# Altium schematic sheet CTR_MCU_Signals.SchDoc: PWM and Sensor Signals
size A4; DrawnBy: Andrei Divinagracia; Revision: 0A; SheetNumber: 7; SheetTotal: 10
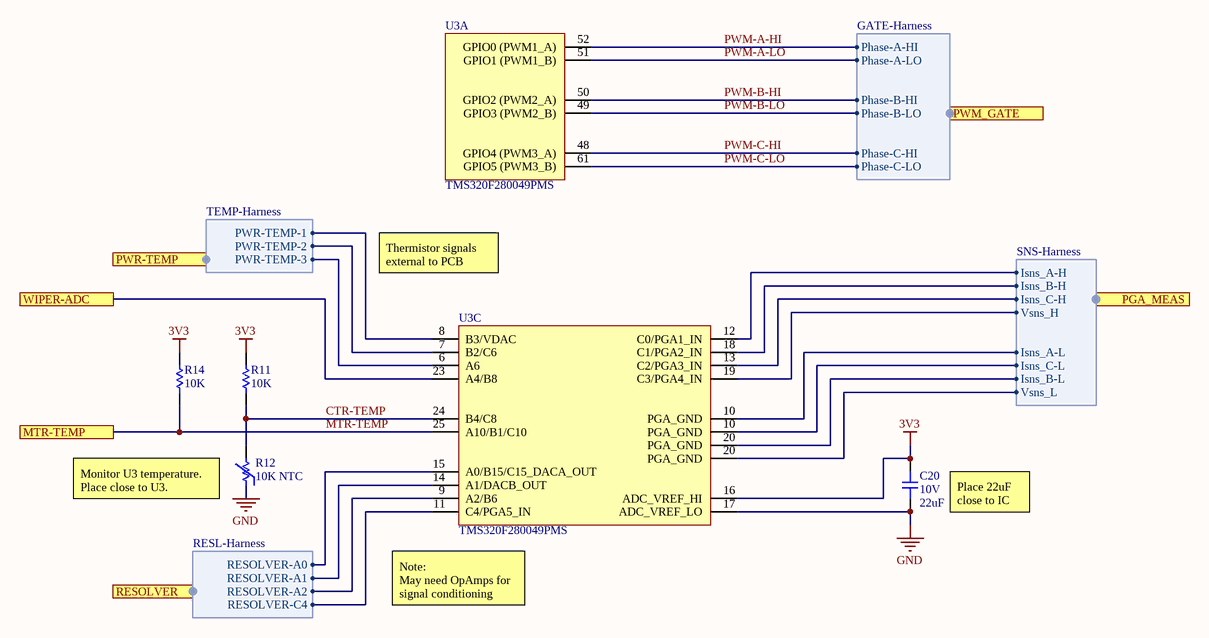
[diagram p0: CTR_MCU_Signals.SchDoc]

## Parts
C20  Voltage Rating: 10V  Capacitance: 22uF  [CAP-0603]  (hidden comment: 0603-22uF-10V)
R11  10K  [RES-0603]
R12  10K NTC  [RES-0603]
R14  10K  [RES-0603]
U3  TMS320F280049PMS  [64QFP]  (parts A,C of 5)

## Ports
MTR-TEMP, PGA_MEAS (harness SNS-Harness), PWM_GATE (harness GATE-Harness), PWR-TEMP (harness TEMP-Harness), RESOLVER (harness RESL-Harness), WIPER-ADC

## Harnesses
SNS-Harness: Isns_A-H, Isns_B-H, Isns_C-H, Vsns_H, Isns_A-L, Isns_B-L, Isns_C-L, Vsns_L
TEMP-Harness: PWR-TEMP-1, PWR-TEMP-2, PWR-TEMP-3
GATE-Harness: Phase-A-HI, Phase-A-LO, Phase-B-HI, Phase-B-LO, Phase-C-LO, Phase-C-HI
RESL-Harness: RESOLVER-A0, RESOLVER-A1, RESOLVER-A2, RESOLVER-C4

## Nets
3V3: C20.2 R11.2 R14.2 U3.16(ADC_VREF_HI)
GND: C20.1 R12.1 U3.17(ADC_VREF_LO)
CTR-TEMP: R11.1 R12.2 U3.24(B4/C8)
MTR-TEMP: R14.1 U3.25(A10/B1/C10) ; port MTR-TEMP
PWM-A-HI: U3.52(GPIO0_(PWM1_A)) ; port PWM_GATE.Phase-A-HI
PWM-A-LO: U3.51(GPIO1_(PWM1_B)) ; port PWM_GATE.Phase-A-LO
PWM-B-HI: U3.50(GPIO2_(PWM2_A)) ; port PWM_GATE.Phase-B-HI
PWM-B-LO: U3.49(GPIO3_(PWM2_B)) ; port PWM_GATE.Phase-B-LO
PWM-C-HI: U3.48(GPIO4_(PWM3_A)) ; port PWM_GATE.Phase-C-HI
PWM-C-LO: U3.61(GPIO5_(PWM3_B)) ; port PWM_GATE.Phase-C-LO
WIPER-ADC: U3.23(A4/B8) ; port WIPER-ADC
NetU3_6: U3.6(A6) ; port PWR-TEMP.PWR-TEMP-3
NetU3_7: U3.7(B2/C6) ; port PWR-TEMP.PWR-TEMP-2
NetU3_8: U3.8(B3/VDAC) ; port PWR-TEMP.PWR-TEMP-1
NetU3_9: U3.9(A2/B6) ; port RESOLVER.RESOLVER-A2
NetU3_10: U3.10(PGA_GND) ; port PGA_MEAS.Isns_C-L
NetU3_10: U3.10(PGA_GND) ; port PGA_MEAS.Isns_A-L  [a separate net that carries the same name]
NetU3_11: U3.11(C4/PGA5_IN) ; port RESOLVER.RESOLVER-C4
NetU3_12: U3.12(C0/PGA1_IN) ; port PGA_MEAS.Isns_A-H
NetU3_13: U3.13(C2/PGA3_IN) ; port PGA_MEAS.Isns_C-H
NetU3_14: U3.14(A1/DACB_OUT) ; port RESOLVER.RESOLVER-A1
NetU3_15: U3.15(A0/B15/C15_DACA_OUT) ; port RESOLVER.RESOLVER-A0
NetU3_18: U3.18(C1/PGA2_IN) ; port PGA_MEAS.Isns_B-H
NetU3_19: U3.19(C3/PGA4_IN) ; port PGA_MEAS.Vsns_H
NetU3_20: U3.20(PGA_GND) ; port PGA_MEAS.Isns_B-L
NetU3_20: U3.20(PGA_GND) ; port PGA_MEAS.Vsns_L  [a separate net that carries the same name]

## Notes on the sheet
- Thermistor signals external to PCB
- (near R12) Monitor U3 temperature. Place close to U3.
- (near C20) Place 22uF close to IC
- (near U3) Note:
  May need OpAmps for signal conditioning

## Library data of the parts
C20 = 0603-22uF-10V: CAP CER 22UF 10V X5R 0603; Manufacturer: Murata; Manufacturer Part Number: GRM187R61A226ME15D; Tolerance: 20%; Supplier 1: Digi-Key; Stock 1: 534733; Pricing 1: 1=0.54, 10=0.381, 50=0.2884, 100=0.2512, 500=0.18608, 1000=0.15816 (USD); Mount: Surface Mount; Case/Package: 0603; Case Code (Metric): 1608; Case Code (Imperial): 0603; Min Operating Temperature: -55°C; Max Operating Temperature: 85°C; Packaging: Tape and Reel; Voltage Rating (DC): 10V; Dielectric: X5R; Length: 0.063inch; Width: 0.031inch; Thickness: 0.031inch; RoHS Compliant: Yes; ComponentLink1URL: http://search.murata.co.jp/Ceramy/image/img/A01X/G101/ENG/GRM187R61A226ME15-01.pdf?src-supplier=Digi-Key; ComponentLink1Description: http://search.murata.co.jp/Ceramy/image/img/A01X/G101/ENG/GRM187R61A226ME15-01.pdf?src-supplier=Digi-Key; Supplier Part Number 1: 490-13243-1-ND
R11 R14 = 0603-10KR: RES SMD 10K OHM 5% 1/10W 0603; Manufacturer: Yageo; Manufacturer Part Number: RC0603JR-0710KL; Resistance: 10kR; Voltage Rating (DC): 50V; Temperature Coefficient: 100ppm/°C; Power Rating: 100mW; Supplier 1: Digi-Key; Stock 1: 3006558; Pricing 1: 1=0.1, 10=0.019, 100=0.0077, 1000=0.00347, 2500=0.00301 (USD); Case/Package: 0603; Number of Pins: 2; Contact Plating: Tin,Matte; Case Code (Imperial): 0603; Case Code (Metric): 1608; Min Operating Temperature: -55°C; Max Operating Temperature: 155°C; Packaging: Tape and Reel; Tolerance: 5%; Composition: Thick Film; Voltage Rating: 50V; Termination: SMD/SMT; Military Standard: Not; Features: Moisture Resistant; Max Power Dissipation: 100mW; Number of Terminations: 2; Length: 0.063inch; Width: 0.031inch; Depth: 0.8mm; Height - Seated (Max): 0.022inch; Radiation Hardening: No; REACH SVHC: Unknown; Lead Free: Lead Free; ComponentLink1URL: http://www.yageo.com/documents/recent/PYu-RC_Group_51_RoHS_L_10.pdf?src-supplier=Digi-Key; ComponentLink1Description: http://www.yageo.com/documents/recent/PYu-RC_Group_51_RoHS_L_10.pdf?src-supplier=Digi-Key; Supplier Part Number 1: 311-10KGRDKR-ND
R12 = 0603-10K-thermistor: THERMISTOR NTC 10KOHM 3380K 0603; Manufacturer: Murata; Manufacturer Part Number: NCP18XH103F03RB; Resistance: 10kR; Tolerance: 1%; Power Rating: 100mW; Current Rating: 310uA; Accuracy: 0.7%; Supplier 1: Digi-Key; Stock 1: 66922; Pricing 1: 1=0.24, 5=0.23, 10=0.204, 25=0.1876, 50=0.15, 100=0.1286, 500=0.1125, 1000=0.09643 (USD); Mount: Surface Mount; Case/Package: 0603; Number of Pins: 2; Case Code (Metric): 1608; Case Code (Imperial): 0603; Number of Terminals: 2; Min Operating Temperature: -40°C; Max Operating Temperature: 125°C; Packaging: Tape and Reel; Package Quantity: 1; Termination: SMD/SMT; Max Power Dissipation: 100mW; Length: 1.6mm; Height: 0.8mm; Depth: 0.8mm; Radiation Hardening: No; REACH SVHC: No SVHC; Lead Free: Lead Free; ComponentLink1URL: http://www.mouser.com/ds/2/281/r44e-522712.pdf?src-supplier=Mouser; ComponentLink1Description: http://www.mouser.com/ds/2/281/r44e-522712.pdf?src-supplier=Mouser; ComponentLink2URL: http://uk.rs-online.com/webdocs/07f1/0900766b807f1e39.pdf?src-supplier=RSComponents; ComponentLink2Description: http://uk.rs-online.com/webdocs/07f1/0900766b807f1e39.pdf?src-supplier=RSComponents; ComponentLink3URL: http://www.murata.com/~/media/webrenewal/support/library/catalog/products/thermistor/ntc/r44e.ashx?src-supplier=Avnet; ComponentLink3Description: http://www.murata.com/~/media/webrenewal/support/library/catalog/products/thermistor/ntc/r44e.ashx?src-supplier=Avnet; ComponentLink4URL: https://www.verical.com/server-webapp/html/getDatasheet?partID=153236&src-supplier=Verical; ComponentLink4Description: https://www.verical.com/server-webapp/html/getDatasheet?partID=153236&src-supplier=Verical; ComponentLink5URL: https://www.murata.com/~/media/webrenewal/support/library/catalog/products/thermistor/ntc/r44e.ashx?la=en-us&src-supplier=Digi-Key; ComponentLink5Description: https://www.murata.com/~/media/webrenewal/support/library/catalog/products/thermistor/ntc/r44e.ashx?la=en-us&src-supplier=Digi-Key; ComponentLink6URL: http://search.murata.co.jp/Ceramy/image/img/w_hinm/L0770E.pdf?src-supplier=Future+Electronics; ComponentLink6Description: http://search.murata.co.jp/Ceramy/image/img/w_hinm/L0770E.pdf?src-supplier=Future+Electronics; ComponentLink7URL: http://search.murata.co.jp/Ceramy/image/img/w_hinm/L0770E.pdf?src-supplier=Avnet+Europe; ComponentLink7Description: http://search.murata.co.jp/Ceramy/image/img/w_hinm/L0770E.pdf?src-supplier=Avnet+Europe; Supplier Part Number 1: 490-4800-6-ND
U3 = TMS320F280049: IC MCU 32BIT 256KB FLASH 64LQFP; Manufacturer: Texas Instruments; Manufacturer Part Number: F280049CPMS; Number of UART Channels: 2; Interface: I2C,SPI,UART,USART,SCI; Peripherals: Brown-out Detect/Reset,POR,PWM,WDT; Frequency: 100MHz; Number of I/Os: 26; Oscillator Type: Internal; Supplier 1: Mouser; Stock 1: 0; Pricing 1: 1=10.7, 10=9.68, 50=9.23, 100=8.01, 1000=6.07, 10000=6.07 (USD); Case/Package: LQFP; Min Operating Temperature: -40°C; Max Operating Temperature: 125°C; Memory Type: FLASH; Packaging: Tray; Memory Size: 256KB; RoHS Compliant: Yes; ComponentLink1URL: http://www.ti.com/lit/pdf/sprui33?src-supplier=Digi-Key; ComponentLink1Description: http://www.ti.com/lit/pdf/sprui33?src-supplier=Digi-Key; Supplier Part Number 1: 595-F280049CPMS